# EAGLE design beefocus (EAGLE 9.1.0)
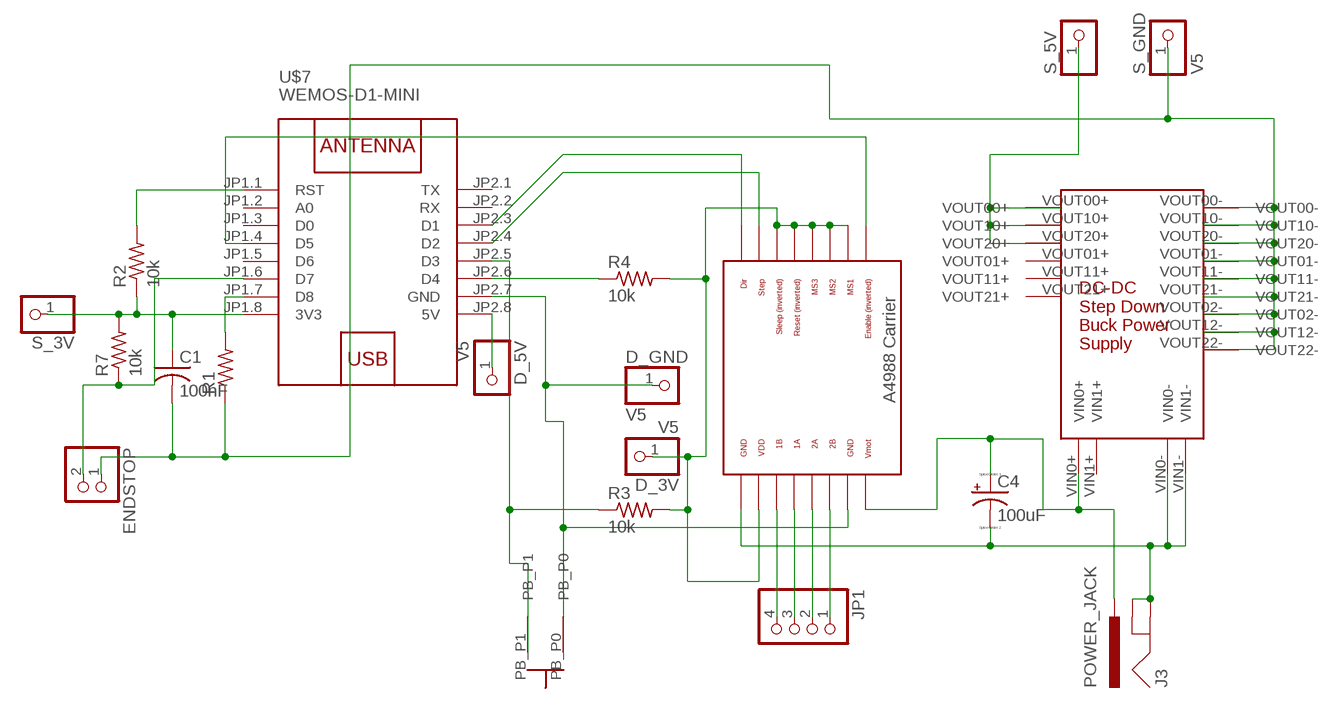
[diagram p0: schematic, sheet 1]

## Parts
C1  100nF  C-US050-024X044  [C050-024X044]
C4  100uF  CPOL-USE3.5-8  [E3,5-8]
D_3V  V5  PINHD-1X1  [1X01]
D_5V  V5  PINHD-1X1  [1X01]
D_GND  V5  PINHD-1X1  [1X01]
ENDSTOP  PINHD-1X2/90  [1X02/90]
J3  POWER_JACK  [POWER_JACK_PTH]
JP1  PINHD-1X4/90  [1X04/90]
R1  R-US_0204/7  [0204/7]
R2  10k  R-US_0204/7  [0204/7]
R3  10k  R-US_0309/V  [0309V]
R4  10k  R-US_0204/7  [0204/7]
R7  10k  R-US_0309/V  [0309V]
S_3V  PINHD-1X1  [1X01]
S_5V  PINHD-1X1  [1X01]
S_GND  V5  PINHD-1X1  [1X01]
U$1  POLOLU_A4983CARRIER  [A4988BREAKOUT]
U$6  DCPOWERCONV_R2  [DCPOWERCONV_R2]
U$7  WEMOS-D1-MINI  [WEMOS-D1-MINI]
U$8  BUTTON6X6X10MMSIDE  [BUTTON6X6X10MMSIDE]

## Nets
N$1: C4.- J3.GND J3.GNDBREAK U$1.GND@0(GND) U$6.VIN0- U$6.VIN1-
N$2: D_5V.1 U$7.JP2.8(5V)
N$3: U$1.STEP U$7.JP2.4(D2)
N$4: U$1.DIR U$7.JP2.3(D1)
N$5: JP1.1 U$1.2B
N$6: JP1.2 U$1.2A
N$7: JP1.3 U$1.1A
N$8: JP1.4 U$1.1B
N$9: C4.+ J3.PWR U$1.VMOT U$6.VIN0+
N$10: R3.1 U$7.JP2.5(D3) U$8.PB_P1
N$11: U$1.EN U$7.JP1.4(D5)
N$14: R2.2 U$7.JP1.1(RST)
N$15: R1.2 U$7.JP1.7(D8)
N$16: D_GND.1 U$1.GND U$7.JP2.7(GND) U$8.PB_P0
N$17: D_3V.1 R3.2 R4.2 U$1.MS1 U$1.MS2 U$1.MS3 U$1.RST U$1.SLP(SLEEP) U$1.VDD
N$20: ENDSTOP.2 R7.1 U$7.JP1.6(D7)
N$22: C1.1 R2.1 R7.2 S_3V.1 U$7.JP1.8(3V3)
N$25: R4.1 U$7.JP2.6(D4)
N$34: C1.2 ENDSTOP.1 R1.1 S_GND.1 U$6.VOUT00- U$6.VOUT01- U$6.VOUT02- U$6.VOUT10- U$6.VOUT11- U$6.VOUT12- U$6.VOUT20- U$6.VOUT21- U$6.VOUT22-
N$35: S_5V.1 U$6.VOUT00+ U$6.VOUT10+ U$6.VOUT20+
Unconnected: U$6.VIN1+ U$6.VOUT01+ U$6.VOUT11+ U$6.VOUT21+ U$7.JP1.2(A0) U$7.JP1.3(D0) U$7.JP1.5(D6) U$7.JP2.1(TX) U$7.JP2.2(RX)

## Library data of the parts
C1 = resistor:C-US: CAPACITOR, American symbol
C4 = resistor:CPOL-US: POLARIZED CAPACITOR, American symbol
D_3V D_5V D_GND S_3V S_5V S_GND = pinhead:PINHD-1X1: PIN HEADER
ENDSTOP = pinhead:PINHD-1X2: PIN HEADER
J3 = SparkFun-Connectors:POWER_JACK: Power Jack Connector This is the standard 5.5mm barrel jack for power. The PTH is the most common, proven, reliable, footprint. The Slot footprint only works if the mill layer is transmitted to the PCB fab house so be warned. Here are the connectors we sell at SparkFun: DC Barrel Power Jack/Connector <https://www.sparkfun.com/products/119> (PRT-00119) DC Barrel Power Jack/Connector (SMD) <https://www.sparkfun.com/products/12748> (PRT-12748) DC Barrel Jack Adapter - Breadboard Compatible <https://www.sparkfun.com/products/10811> (PRT-10811) It is used on this SparkFun product (and many, many others): SparkFun RedBoard - Programmed with Arduino <https://www.sparkfun.com/products/12757> (DEV-12757) Also, if you need a mating power supply or connector, please check these out: Wall Adapter Power Supply - 9VDC 650mA <https://www.sparkfun.com/products/298> (TOL-00298) DC Barrel Jack Adapter - Male <https://www.sparkfun.com/products/10287> (PRT-10287); PROD_ID: CONN-08197
JP1 = pinhead:PINHD-1X4: PIN HEADER
R1-R4 R7 = resistor:R-US_: RESISTOR, American symbol
U$1 = RepRapjr:POLOLU_A4983CARRIER
U$6 = glowmouse_custom:DCPOWERCONV_R2: Unbranded 9V / 12V/ 19V to 3.3V/ 5V DC-DC Step Down Buck Power Supply Module 3A
U$7 = diy-modules:WEMOS-D1-MINI: WEMOS D1 mini: Mini Wi-Fi Board based on ESP-8266 device More details can be found here: https://www.wemos.cc/product/d1-mini.html Click here to find device on ebay.com <http://www.ebay.com/sch/wemos+d1+mini+nodemcu>
U$8 = glowmouse_custom:BUTTON6X6X10MMSIDE

## Board
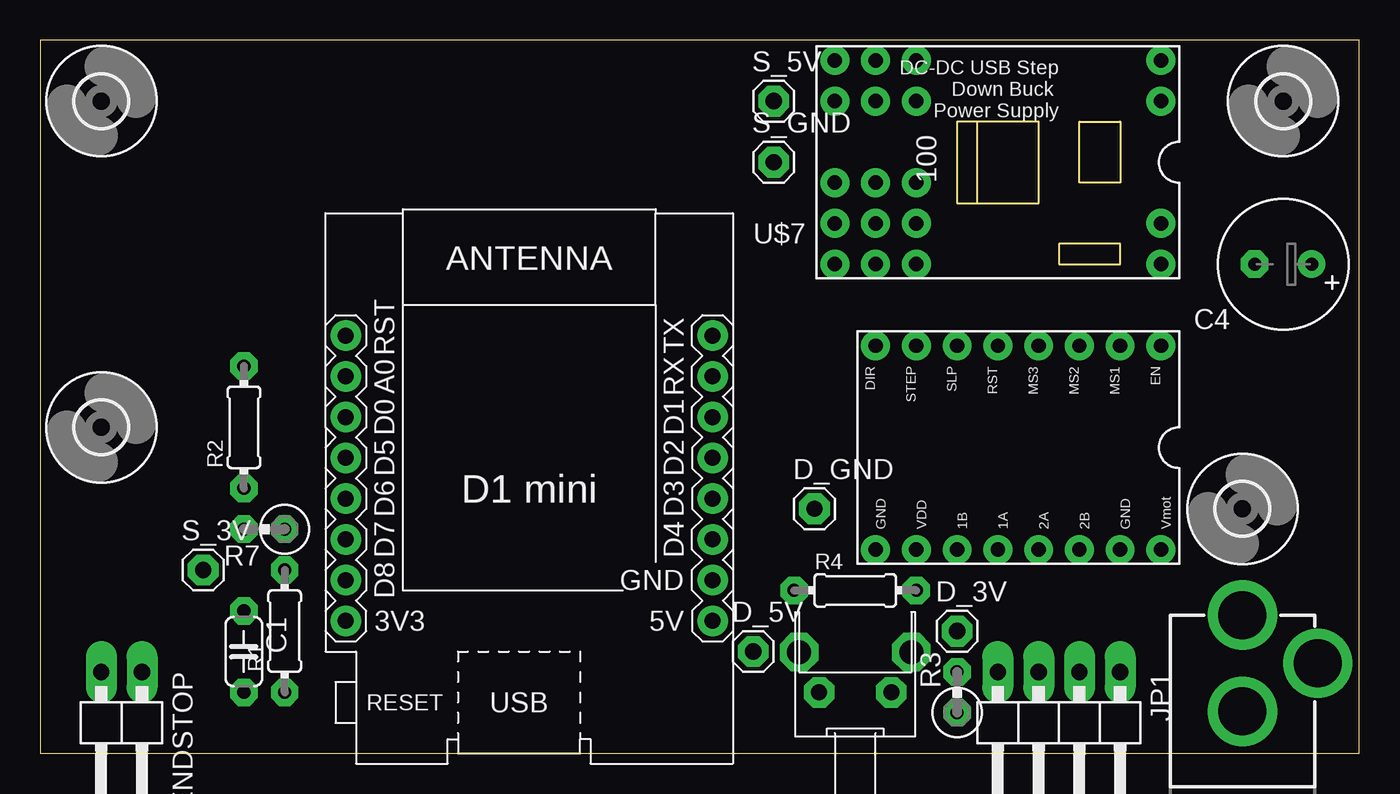
[diagram p1: board, top side]
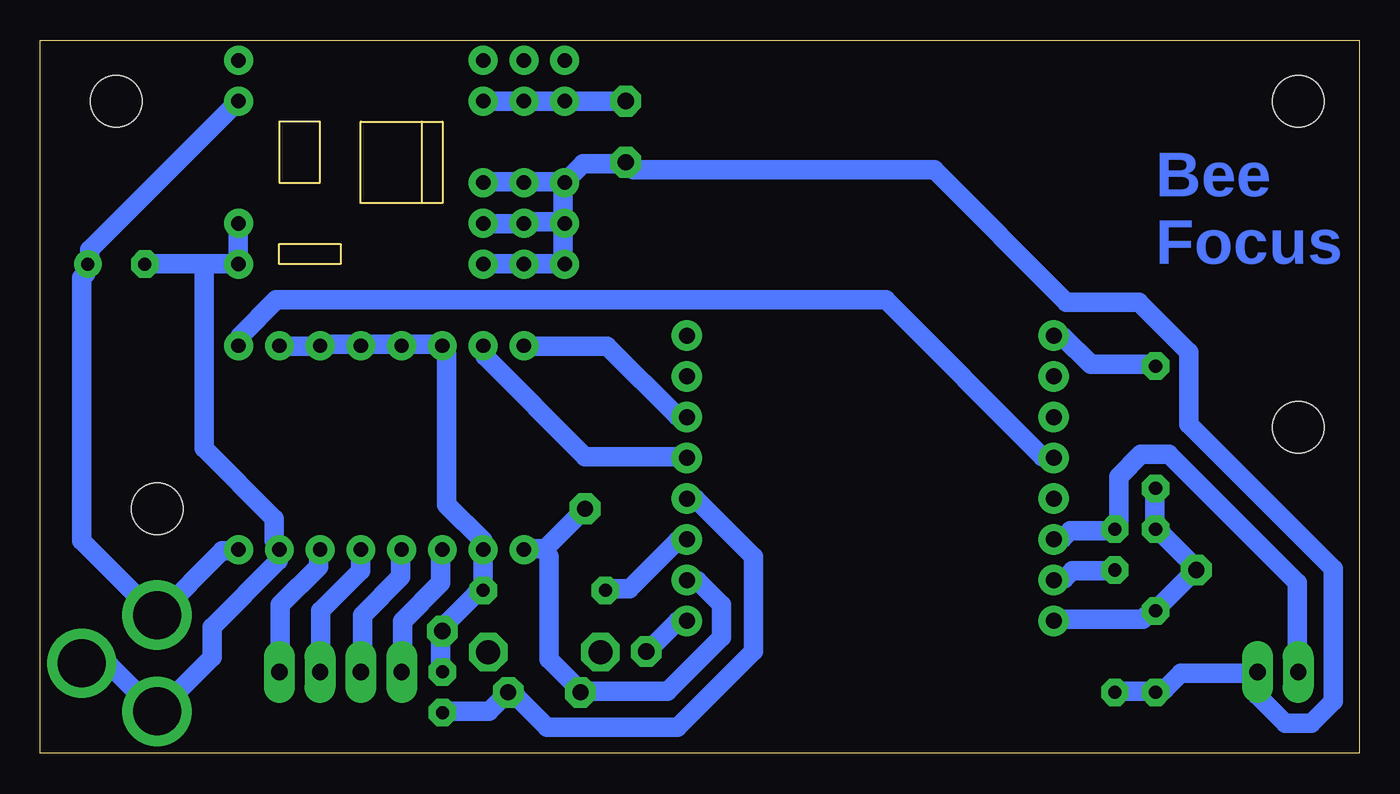
[diagram p2: board, bottom side, seen from below]

Size 82.22 x 44.44 mm. Coordinates in mm from the lower left corner, seen from the top.
Outline: 0,0 82.22,0 82.22,44.44 0,44.44 0,0
Copper layers (1*16): Top 0.035mm / dielectric 1.5mm / Bottom 0.035mm
Design rules "diy_board_drcs *": minimum track width 1.2mm, minimum drill 0.8mm, track to track 0.8mm, track to pad 0.6mm, pad to pad 0.3mm, via to via 1mm, smd to smd 8mil, copper to edge 40mil, drill to drill 8mil, minimum pad ring 0.4mm, minimum via ring 0.6mm, stop-mask expansion 4mil, vias tented up to drill 0mil, thermal gap 10mil

### Footprints (pad centres in the part's own frame; a part is rotated, then mirrored left to right if it is on the bottom)
C050-024X044 = drill 0.813 octagon: 1 -2.54,0; 2 2.54,0
E3,5-8 = drill 0.813 pad 1.6: + -1.778,0 | drill 0.813 pad 1.6 octagon: - 1.778,0
1X01 = drill 1.016 octagon: 1 0,0
1X02/90 = drill 1.016 long: 1 -1.27,-3.81; 2 1.27,-3.81
POWER_JACK_PTH = drill 2.997 pad 4.318: GND 0,7.7; GNDBREAK 4.7,10.7; PWR 0,13.7
1X04/90 = drill 1.016 long: 1 -3.81,-3.81; 2 -1.27,-3.81; 3 1.27,-3.81; 4 3.81,-3.81
0204/7 = drill 0.813 octagon: 1 -3.81,0; 2 3.81,0
0309V = drill 0.813 octagon: 1 -1.27,0; 2 1.27,0
A4988BREAKOUT = drill 0.9: 1A 8.89,1.27; 1B 11.43,1.27; 2A 6.35,1.27; 2B 3.81,1.27; DIR 16.51,-11.43; EN -1.27,-11.43; GND 16.51,1.27; GND@0 1.27,1.27; MS1 1.27,-11.43; MS2 3.81,-11.43; MS3 6.35,-11.43; RST 8.89,-11.43; SLP 11.43,-11.43; STEP 13.97,-11.43; VDD 13.97,1.27; VMOT -1.27,1.27
3,2 = hole 3.2: 0,0
DCPOWERCONV_R2 = drill 0.9: VIN0+ 3.81,-8.89; VIN0- -6.35,-8.89; VIN1+ 6.35,-8.89; VIN1- -3.81,-8.89; VOUT00+ 3.81,11.43; VOUT00- -6.35,11.43; VOUT01+ 6.35,11.43; VOUT01- -3.81,11.43; VOUT02- -1.27,11.43; VOUT10+ 3.81,8.89; VOUT10- -6.35,8.89; VOUT11+ 6.35,8.89; VOUT11- -3.81,8.89; VOUT12- -1.27,8.89; VOUT20+ 3.81,6.35; VOUT20- -6.35,6.35; VOUT21+ 6.35,6.35; VOUT21- -3.81,6.35; VOUT22- -1.27,6.35
WEMOS-D1-MINI = drill 1: JP1.1 -11.43,9.525; JP1.2 -11.43,6.985; JP1.3 -11.43,4.445; JP1.4 -11.43,1.905; JP1.5 -11.43,-0.635; JP1.6 -11.43,-3.175; JP1.7 -11.43,-5.715; JP1.8 -11.43,-8.255; JP2.1 11.43,9.525; JP2.2 11.43,6.985; JP2.3 11.43,4.445; JP2.4 11.43,1.905; JP2.5 11.43,-0.635; JP2.6 11.43,-3.175; JP2.7 11.43,-5.715; JP2.8 11.43,-8.255
BUTTON6X6X10MMSIDE = drill 1.5 octagon: P$3 3.5,2.5; P$4 -3.5,2.5 | drill 1 octagon: PB_P0 -2.25,0; PB_P1 2.25,0

### Placement (x,y rotation side)
C1  12.7,6.35 270 top
C4  77.47,30.48 180 top
D_3V  57.15,7.62 0 top
D_5V  44.45,6.35 0 top
D_GND  48.26,15.24 0 top
ENDSTOP  5.08,1.27 180 top
J3  74.93,-5.08 0 top
JP1  63.5,1.27 180 top
R1  15.24,7.62 90 top
R2  12.7,20.32 90 top
R3  57.15,3.81 90 top
R4  50.8,10.16 0 top
R7  13.97,13.97 180 top
S_3V  10.16,11.43 0 top
S_5V  45.72,40.64 0 top
S_GND  45.72,36.83 0 top
U$1  68.58,13.97 180 top
U$2  [3,2]  3.81,40.64 0 top
U$3  [3,2]  3.81,20.32 0 top
U$4  [3,2]  77.47,40.64 0 top
U$5  [3,2]  74.93,15.24 0 top
U$6  60.96,36.83 90 top
U$7  30.48,16.51 0 top
U$8  50.8,3.81 0 top

### Tracks (layer width: path | path; a pad name or v marks a point on that pad's centre or on a via)
N$1
  Bottom 1.2: 72,30.5 69.88,30.5 U$6.VIN0- 69.88,31 69.88,33 U$6.VIN1- | 72,30.5 75.62,30.5 C4.- | 72,30.5 72,30 72,19 67.62,14.62 67.62,13.25 U$1.GND@0 67.38,12.62 67.38,12 71.5,7.88 71.5,6 74.88,2.62 J3.GND 75.38,3 77.88,5.5 79.62,5.5 J3.GNDBREAK
N$2
  Bottom 1.2: U$7.JP2.8 42,8.25 42.5,8.25 44.38,6.38 D_5V.1
N$3
  Bottom 1.2: U$1.STEP 54.5,25.38 54.5,24.75 48.25,18.5 42,18.5 U$7.JP2.4
N$4
  Bottom 1.2: U$1.DIR 52,25.38 46.88,25.38 42.5,21 42,21 U$7.JP2.3
N$5
  Bottom 1.2: U$1.2B 64.88,12.62 64.88,11.62 67.25,9.25 67.25,5.12 JP1.1
N$6
  Bottom 1.2: U$1.2A 62.25,12.62 62.25,11.38 64.75,8.88 64.75,5.12 JP1.2
N$7
  Bottom 1.2: U$1.1A 59.75,12.62 59.75,11 62.12,8.62 62.12,5.12 JP1.3
N$8
  Bottom 1.2: U$1.1B 57.25,12.62 57.25,10.62 59.62,8.25 59.62,5.12 JP1.4
N$9
  Bottom 1.2: U$1.VMOT 69.88,12.62 70.88,12.62 74.88,8.62 J3.PWR 75.38,9 79.62,13.25 79.62,29.62 79.38,29.88 C4.+ 79.12,30.5 79.12,31.38 69.88,40.62 U$6.VIN0+
N$10
  Bottom 1.2: R3.1 57.12,2.62 54.25,2.62 53.12,3.75 U$8.PB_P1 52.5,3.5 50.62,1.62 42.5,1.62 37.75,6.38 37.75,12.25 41.38,15.88 41.88,15.88 U$7.JP2.5
N$11
  Bottom 1.2: U$1.EN 69.75,25.5 69.75,26 67.5,28.25 29.5,28.25 19.75,18.5 19.12,18.5 U$7.JP1.4
N$14
  Bottom 1.2: R2.2 12.75,24.25 16.75,24.25 18.5,26 19,26 U$7.JP1.1
N$15
  Bottom 1.2: R1.2 15.25,11.38 17.88,11.38 18.38,10.88 19,10.88 U$7.JP1.7
N$16
  Bottom 1.2: 50.75,12.75 52,12.75 U$1.GND | 50.75,12.75 48.38,15.12 D_GND.1 | U$7.JP2.7 41.88,10.75 41.25,10.75 39.75,9.25 39.75,7.25 43.12,3.88 48.5,3.88 U$8.PB_P0 48.88,4.25 50.5,5.88 50.5,12.25 50.75,12.75
N$17
  Bottom 1.2: U$1.MS1 67.25,25.38 65.38,25.38 U$1.MS2 64.75,25.5 62.75,25.5 U$1.MS3 62.12,25.5 60.25,25.5 U$1.RST 59.62,25.5 57.25,25.5 U$1.SLP 56.88,24.88 56.88,15.5 54.62,13.25 U$1.VDD 54.62,12.62 54.62,10.25 R4.2 55.12,9.88 56.88,8.12 D_3V.1 57.25,7.5 57.25,5.12 R3.2
N$20
  Bottom 1.2: U$7.JP1.6 19,13.38 18.5,13.38 18,13.88 15.25,13.88 R7.1 15,14.5 15,17.25 13.62,18.62 11.88,18.62 3.88,10.62 3.88,5.12 ENDSTOP.2
N$22
  Bottom 1.2: R2.1 12.75,16.5 12.75,14 R7.2 12.25,13.62 10.5,11.88 S_3V.1 10.25,11.38 12.62,9 C1.1 13.25,8.62 13.5,8.38 19,8.38 U$7.JP1.8
N$25
  Bottom 1.2: R4.1 46.88,10.25 45.5,10.25 42.5,13.25 42,13.25 U$7.JP2.6
N$34
  Bottom 1.2: R1.1 15.12,3.88 12.75,3.88 C1.2 12.12,4 11.12,5 6.38,5 ENDSTOP.1 6.38,4.38 6.38,3.62 4.62,1.88 3,1.88 1.62,3.25 1.62,11.5 10.62,20.5 10.62,25 13.75,28.12 18.25,28.12 26.5,36.38 45.25,36.38 S_GND.1 45.75,36.75 48.38,36.75 49.12,36 U$6.VOUT02- | U$6.VOUT01- 49.62,33 49.62,31 U$6.VOUT00- 49.62,30.5 52,30.5 U$6.VOUT10- 52.62,30.5 54.5,30.5 U$6.VOUT20- | U$6.VOUT01- 50.25,33.12 52,33.12 U$6.VOUT11- 52.62,33 54.5,33 U$6.VOUT21- | U$6.VOUT02- 49.62,35.5 49.62,33.62 U$6.VOUT01- | U$6.VOUT02- 50.12,35.62 52,35.62 U$6.VOUT12- 52.62,35.62 54.5,35.62 U$6.VOUT22-
N$35
  Bottom 1.2: S_5V.1 45.75,40.62 49,40.62 U$6.VOUT00+ 49.62,40.62 52,40.62 U$6.VOUT10+ 52.62,40.62 54.5,40.62 U$6.VOUT20+

### Text on the board
Bottom: Bee / Focus